# Altium schematic sheet Radio.SchDoc
size A4
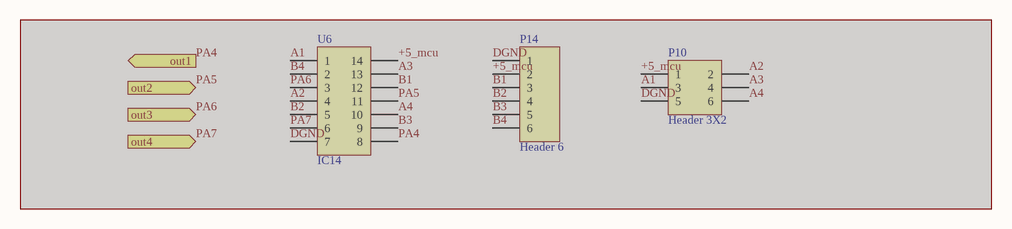
[diagram p0: Radio.SchDoc]

## Parts
P10  Header 3X2  [HDR2X3_]  (masked out: inside a compile mask, not in the netlist)
P14  Header 6  [HDR1X6]  (masked out: inside a compile mask, not in the netlist)
U6  IC14  [SOP_14]  (masked out: inside a compile mask, not in the netlist)

## Ports
out1 (out), out2 (out), out3 (out), out4 (out)

## Library data of the parts
P10 = Header 3X2: Header, 3-Pin, Dual row; LatestRevisionDate: 17-Jul-2002; LatestRevisionNote: Re-released for DXP Platform.; Publisher: Altium Limited
P14 = Header 6: Header, 6-Pin; LatestRevisionDate: 17-Jul-2002; LatestRevisionNote: Re-released for DXP Platform.; Publisher: Altium Limited
U6 = IC_14